# EAGLE design bubbledisplayfrontpack.v02 (EAGLE 6.6.0)
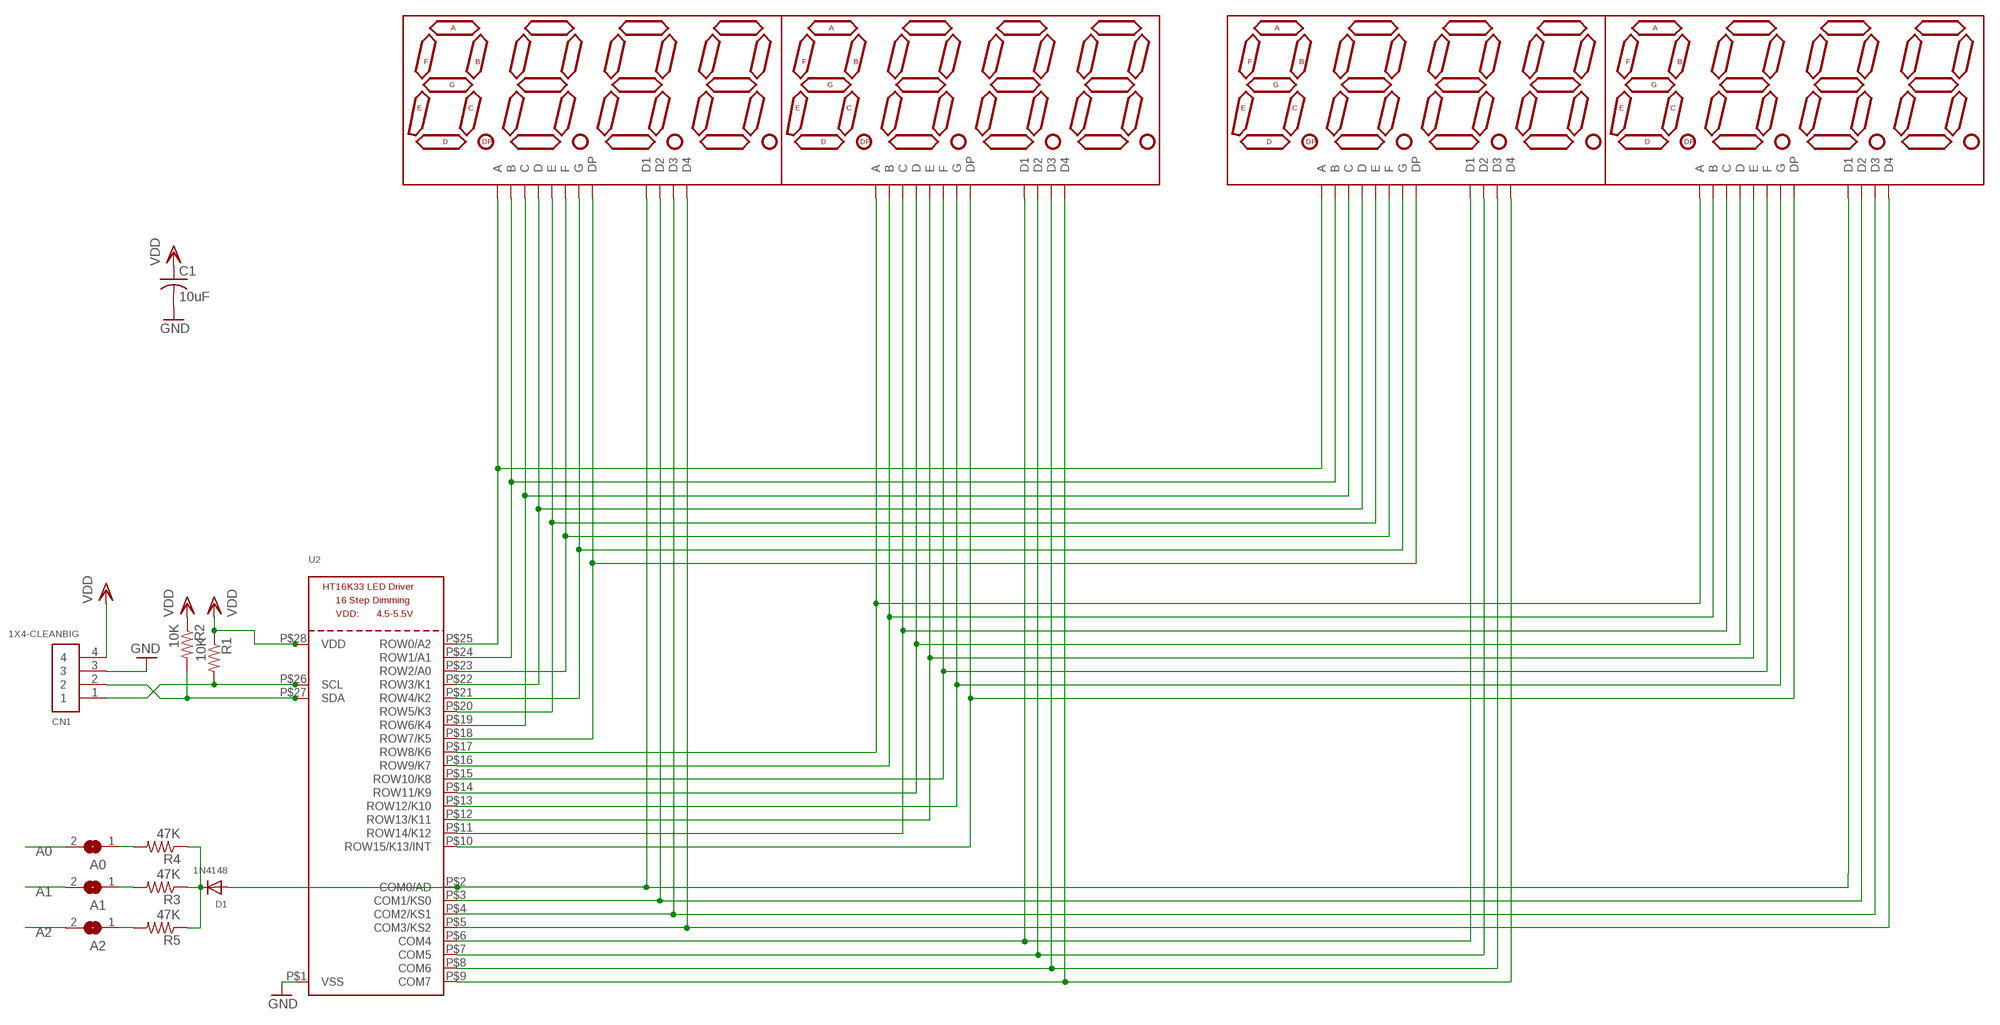
[diagram p0: schematic, sheet 1]

## Parts
A0  SOLDERJUMPERREFLOW_NOPASTE  [SOLDERJUMPER_REFLOW_NOPASTE]
A1  SOLDERJUMPERREFLOW_NOPASTE  [SOLDERJUMPER_REFLOW_NOPASTE]
A2  SOLDERJUMPERREFLOW_NOPASTE  [SOLDERJUMPER_REFLOW_NOPASTE]
C1  10uF  C-USC0805K  [C0805K]
CN1  1X4-CLEANBIG  [1X04-CLEANBIG]
D1  1N4148  DIODESOD-323F  [SOD-323F]
DISPLAY1  hp  7-SEGMENT-4DIGIT-COUNTER-HP-BUBBLE  [DIL12]
DISPLAY2  hp  7-SEGMENT-4DIGIT-COUNTER-HP-BUBBLE  [DIL12]
DISPLAY3  hp  7-SEGMENT-4DIGIT-COUNTER-HP-BUBBLE  [DIL12]
DISPLAY4  hp  7-SEGMENT-4DIGIT-COUNTER-HP-BUBBLE  [DIL12]
R1  10K  R-US_R0805  [R0805]
R2  10K  R-US_R0805  [R0805]
R3  47K  R-US_R0805  [R0805]
R4  47K  R-US_R0805  [R0805]
R5  47K  R-US_R0805  [R0805]
U2  HT16K33_SOP28  [SOP28_300MIL]

## Nets
A0: A0.2 DISPLAY1.9(F) DISPLAY3.9(F) U2.P$23(ROW2/A0)
A1: A1.2 DISPLAY1.11(B) DISPLAY3.11(B) U2.P$24(ROW1/A1)
A2: A2.2 DISPLAY1.12(A) DISPLAY3.12(A) U2.P$25(ROW0/A2)
C0P1: D1.A DISPLAY2.1(D1) DISPLAY3.1(D1) U2.P$2(COM0/AD)
C1P10: DISPLAY2.10(D2) DISPLAY3.10(D2) U2.P$3(COM1/KS0)
C2P4: DISPLAY2.4(D3) DISPLAY3.4(D3) U2.P$4(COM2/KS1)
C3P6: DISPLAY2.6(D4) DISPLAY3.6(D4) U2.P$5(COM3/KS2)
C4P1: DISPLAY1.1(D1) DISPLAY4.1(D1) U2.P$6(COM4)
C5P10: DISPLAY1.10(D2) DISPLAY4.10(D2) U2.P$7(COM5)
C6P4: DISPLAY1.4(D3) DISPLAY4.4(D3) U2.P$8(COM6)
C7P6: DISPLAY1.6(D4) DISPLAY4.6(D4) U2.P$9(COM7)
GND: C1.2 CN1.3 U2.P$1(VSS)
N$1: D1.C R3.1 R4.1 R5.1
N$3: DISPLAY1.8(D) DISPLAY3.8(D) U2.P$22(ROW3/K1)
N$5: DISPLAY2.9(F) DISPLAY4.9(F) U2.P$15(ROW10/K8)
N$7: A2.1 R5.2
N$8: DISPLAY2.2(E) DISPLAY4.2(E) U2.P$12(ROW13/K11)
N$19: A1.1 R3.2
N$20: A0.1 R4.2
SCL: CN1.1 R1.2 U2.P$26(SCL)
SDA: CN1.2 R2.2 U2.P$27(SDA)
SEGAD24P12: DISPLAY2.12(A) DISPLAY4.12(A) U2.P$17(ROW8/K6)
SEGBD24P11: DISPLAY2.11(B) DISPLAY4.11(B) U2.P$16(ROW9/K7)
SEGCP3: DISPLAY2.3(C) DISPLAY4.3(C) U2.P$11(ROW14/K12)
SEGD13EP2: DISPLAY1.7(G) DISPLAY3.7(G) U2.P$21(ROW4/K2)
SEGD13GP7: DISPLAY1.3(C) DISPLAY3.3(C) U2.P$19(ROW6/K4)
SEGDD24P8: DISPLAY2.8(D) DISPLAY4.8(D) U2.P$14(ROW11/K9)
SEGDPD13P5: DISPLAY1.5(DP) DISPLAY3.5(DP) U2.P$18(ROW7/K5)
SEGDPP5: DISPLAY2.5(DP) DISPLAY4.5(DP) U2.P$10(ROW15/K13/INT)
SEGED13P2: DISPLAY1.2(E) DISPLAY3.2(E) U2.P$20(ROW5/K3)
SEGFP9: DISPLAY2.7(G) DISPLAY4.7(G) U2.P$13(ROW12/K10)
VDD: C1.1 CN1.4 R1.1 R2.1 U2.P$28(VDD)

## Library data of the parts
A0 A1 A2 = microbuilder:SOLDERJUMPER: SMD Solder JUMPER Solder the two pads together to create a connection, or remove the solder to break it. REFLOW - Use this footprint for solder paste and reflow ovens. WAVE - Use this footprint for hand-soldering (larger pads). CLOSED - Has a trace between the two pads to ensure it is closed by default. The trace needs to be cut to disable the jumper, and can be closed again by creating a solder bridge between the two pads.
C1 = adafruit:C-US: CAPACITOR, American symbol
CN1 = adafruit:1X4: 4-pin connector
D1 = adafruit:DIODE: Diode SMADIODE - SMA Surface Mount Package 20V 1A Schottky Diode Digikey: 641-1014-6-ND DO-1N4148 - Through Hole Small Current Diode SOD-123 20V 1 A (.5mV Vf) Schottky Diode - Digikey: MBRX120TPMSCT-ND SOD-323 10V 570mA (.38mV Vf, 3ns) Schottky Diode - Digikey: ZLLS410CT-ND SOD-523 30V 30mA Schottky Diode (RB751S-40TE61) - Digikey: RB751S-40TE61CT-ND SOT23-R/W - SOT23 Package (R = Solder Paste/Reflow Ovens, W = Hand-Soldering) BAT54Film 40V 300mA - Digikey: 497-7162-1-ND
DISPLAY1-DISPLAY4 = SparkFun-Displays:7-SEGMENT-4DIGIT-COUNTER
R1-R5 = adafruit:R-US_: RESISTOR, American symbol
U2 = microbuilder:HT16K33_SOP28

## Board
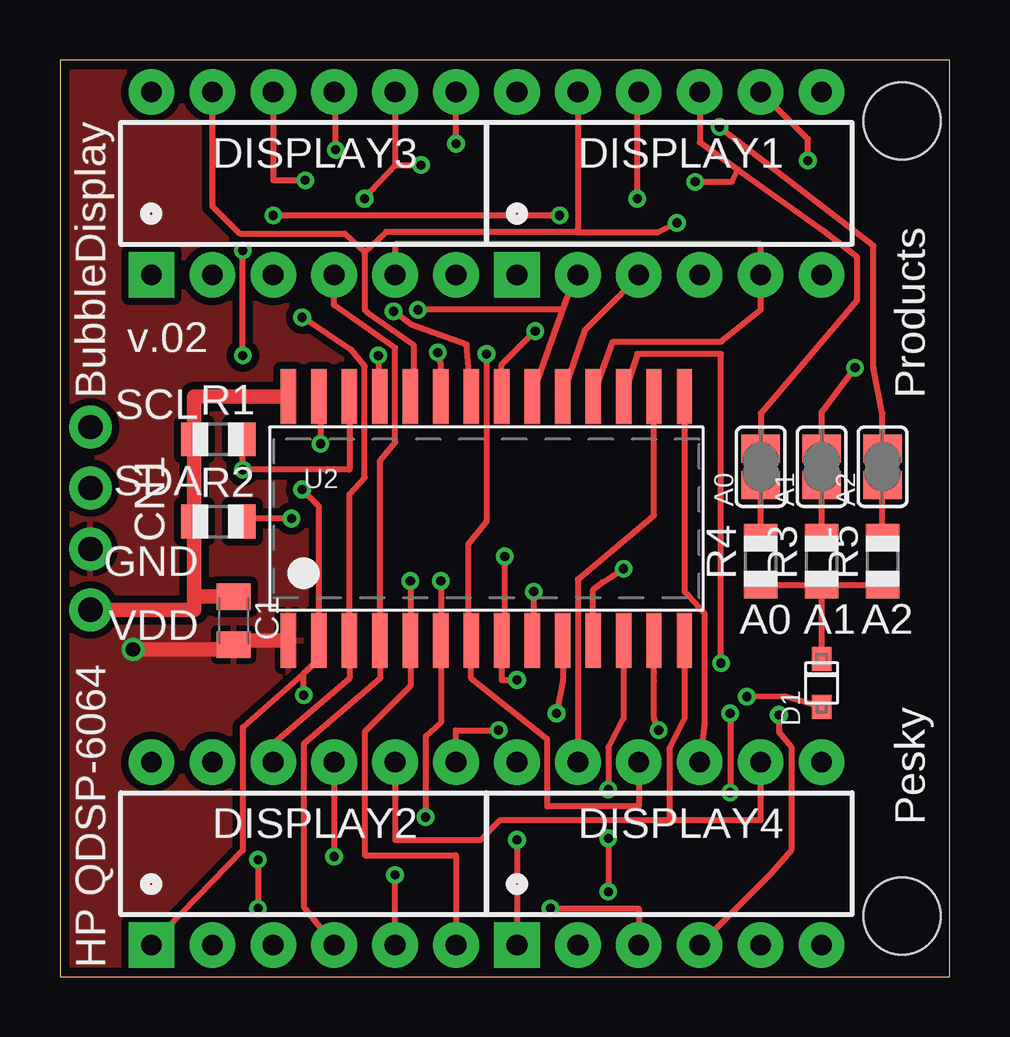
[diagram p1: board, top side]
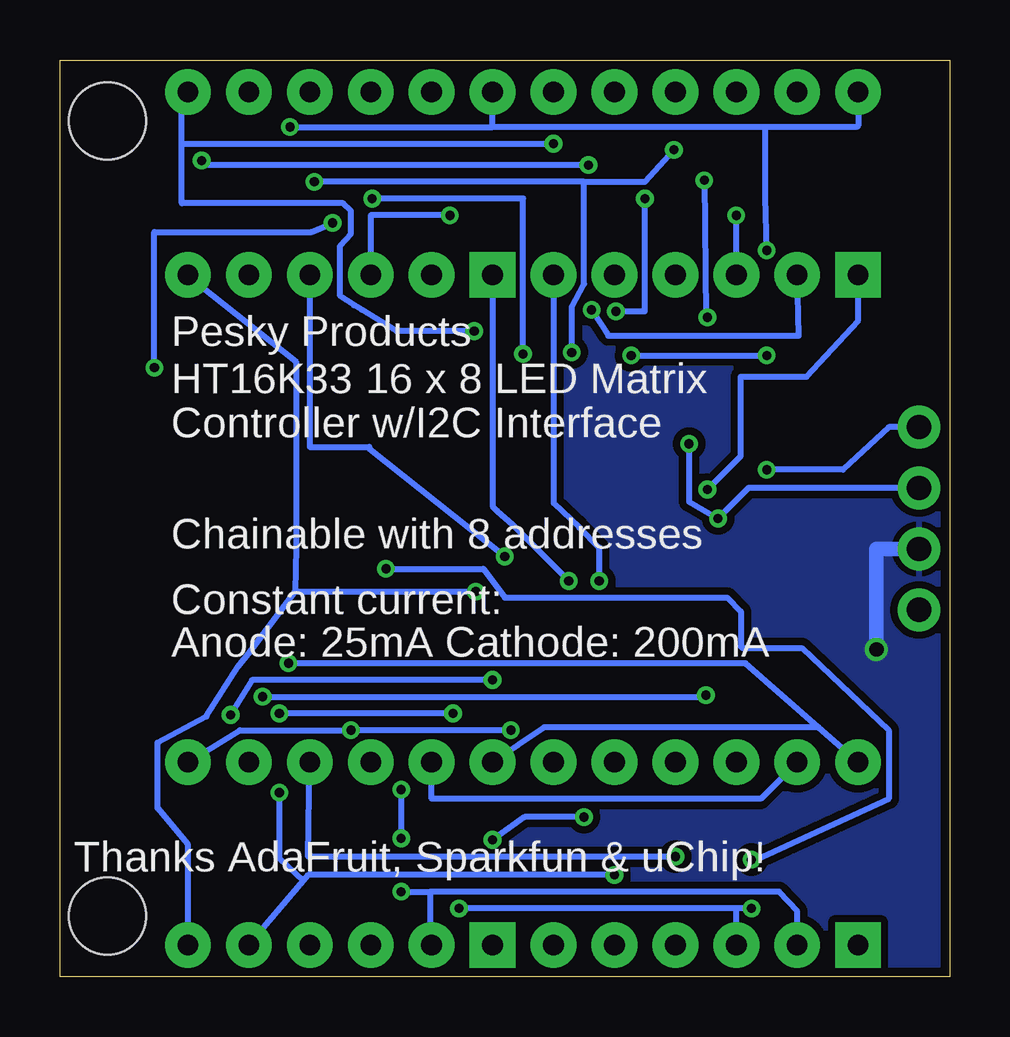
[diagram p2: board, bottom side, seen from below]

Size 37.08 x 38.23 mm. Coordinates in mm from the lower left corner, seen from the top.
Outline: 0,38.23 0,0 37.08,0 37.08,38.23 0,38.23
Copper layers (1*16): Top 0.0356mm / dielectric 1.5011mm / Bottom 0.0356mm
Design rules "OSHPark *": minimum track width 6mil, minimum drill 13mil, track to track 6mil, track to pad 6mil, pad to pad 6mil, via to via 6mil, smd to smd 6mil, copper to edge 15mil, drill to drill 6mil, minimum pad ring 7mil, minimum via ring 7mil, stop-mask expansion 3mil, vias tented up to drill 25mil, thermal gap 10mil
Holes 3.2 mm at 35.11,35.69 35.11,2.54

### Footprints (pad centres in the part's own frame; a part is rotated, then mirrored left to right if it is on the bottom)
SOLDERJUMPER_REFLOW_NOPASTE = smd 1.168 x 1.6: 1 -0.762,0; 2 0.762,0
C0805K = smd 1.1 x 1.4: 1 -1,0; 2 1,0
1X04-CLEANBIG = drill 1.016 pad 1.778: 1 -3.81,0; 2 -1.27,0; 3 1.27,0; 4 3.81,0
SOD-323F = smd 1 x 0.8: A -1,0; C 1,0
DIL12 = drill 0.864 pad 1.905 square: 1 -6.35,-3.81 | drill 0.864 pad 1.905: 2 -3.81,-3.81; 3 -1.27,-3.81; 4 1.27,-3.81; 5 3.81,-3.81; 6 6.35,-3.81; 7 6.35,3.81; 8 3.81,3.81; 9 1.27,3.81; 10 -1.27,3.81; 11 -3.81,3.81; 12 -6.35,3.81
R0805 = smd 1.1 x 1.4: 1 -1,0; 2 1,0
SOP28_300MIL = smd 0.635 x 2.286: P$1 -8.255,-5.08; P$2 -6.985,-5.08; P$3 -5.715,-5.08; P$4 -4.445,-5.08; P$5 -3.175,-5.08; P$6 -1.905,-5.08; P$7 -0.635,-5.08; P$8 0.635,-5.08; P$9 1.905,-5.08; P$10 3.175,-5.08; P$11 4.445,-5.08; P$12 5.715,-5.08; P$13 6.985,-5.08; P$14 8.255,-5.08; P$15 8.255,5.08; P$16 6.985,5.08; P$17 5.715,5.08; P$18 4.445,5.08; P$19 3.175,5.08; P$20 1.905,5.08; P$21 0.635,5.08; P$22 -0.635,5.08; P$23 -1.905,5.08; P$24 -3.175,5.08; P$25 -4.445,5.08; P$26 -5.715,5.08; P$27 -6.985,5.08; P$28 -8.255,5.08

### Placement (x,y rotation side)
A0  29.21,21.27 90 top
A1  31.75,21.27 90 top
A2  34.29,21.27 90 top
C1  7.24,14.86 270 top
CN1  1.27,19.11 270 top
D1  31.75,12.26 90 top
DISPLAY1  25.4,33.08 0 top
DISPLAY2  10.16,5.14 0 top
DISPLAY3  10.16,33.08 0 top
DISPLAY4  25.4,5.14 0 top
R1  6.6,22.42 0 top
R2  6.6,18.99 0 top
R3  31.75,17.34 90 top
R4  29.21,17.34 90 top
R5  34.29,17.34 90 top
U2  17.78,19.11 0 top

### Tracks (layer width: path | path; a pad name or v marks a point on that pad's centre or on a via)
A0  (via drill 0.38)
  Top 0.254: DISPLAY1.9 26.67,34.8 28.26,33.66 | 28.26,33.66 31.81,31.11 33.21,30.04 33.21,28.19 29.21,23.5 A0.2 | U2.P$23 15.88,25.53 v15.75,26.04 | v11.49,34.48 11.49,36.83 DISPLAY3.9 | v26.48,33.15 28,33.15 28.26,33.66
  Bottom 0.254: v15.75,26.04 15.75,27.94 15.24,28.89 15.24,33.15 | 15.24,33.15 12.7,33.15 v11.49,34.48 | 15.24,33.15 v26.48,33.15
A1  (via drill 0.38)
  Top 0.254: DISPLAY3.11 6.35,32.13 7.49,30.99 11.87,30.99 12.7,30.23 | 12.7,30.23 12.7,27.81 12.83,27.69 14.73,26.35 14.73,24.32 U2.P$24 | DISPLAY1.11 21.59,31.18 21.53,31.05 | 21.53,31.05 24.96,31.05 v25.72,31.43 | 21.53,31.05 13.59,31.05 12.7,30.23 | A1.2 31.75,23.56 v33.15,25.4
  Bottom 0.254: v33.15,25.4 33.15,31.05 26.61,31.05 v25.72,31.43
A2  (via drill 0.38)
  Top 0.254: v27.5,35.43 33.91,30.48 33.91,25.4 34.29,23.5 A2.2 | U2.P$25 v13.27,25.91 | v7.62,25.91 v7.62,30.29
  Bottom 0.254: DISPLAY3.12 3.81,35.5 3.87,35.43 7.68,35.43 | 7.68,35.43 19.05,35.43 | 19.05,35.43 DISPLAY1.12 | v27.5,35.43 19.05,35.43 | v13.27,25.91 v7.62,25.91 | v7.62,30.29 7.68,32.51 7.68,35.43
C0P1  (via drill 0.38)
  Top 0.254: 10.31,12.81 10.79,13.27 U2.P$2 10.79,19.62 v10.1,20.32 | 10.31,12.81 7.62,10.41 7.62,5.27 DISPLAY2.1 | D1.A 30.21,11.7 v28.64,11.68 | v10.16,11.75 10.16,12.66 10.31,12.81
  Bottom 0.254: v28.64,11.68 10.35,11.68 v10.16,11.75 | v10.1,20.32 8.7,21.72 8.7,25.02 5.97,25.02 3.81,27.37 DISPLAY3.1
C1P10  (via drill 0.38)
  Top 0.254: DISPLAY2.10 8.89,9.72 9.78,10.48 12.06,12.45 U2.P$3 12.06,20.13 12.7,20.83 12.7,25.46 12.13,26.16 10.16,27.5 v10.1,27.5 | DISPLAY3.10 8.89,33.21 v10.22,33.21
  Bottom 0.254: v10.22,33.21 10.16,27.56 v10.1,27.5
C2P4
  Top 0.254: DISPLAY2.4 10.16,2.92 10.16,9.72 13.34,12.45 U2.P$4 13.34,21.53 13.97,22.29 13.97,26.23 11.43,28 DISPLAY3.4
C3P6  (via drill 0.38)
  Top 0.254: DISPLAY2.6 16.51,5.08 12.7,5.08 12.7,10.22 14.61,12.13 U2.P$5 v14.61,16.51
  Bottom 0.254: DISPLAY3.6 16.51,19.75 15.43,18.73 14.61,17.91 v14.61,16.51
C4P1  (via drill 0.38)
  Top 0.254: v15.88,16.51 U2.P$6 15.88,10.6 15.24,10.03 v15.24,6.67 | v19.05,5.71 DISPLAY4.1
  Bottom 0.254: DISPLAY1.1 19.05,19.62 18.86,19.43 18.22,18.86 v15.88,16.51 | v15.24,6.67 17.72,6.67 v19.05,5.71
C5P10  (via drill 0.38)
  Top 0.254: v17.78,25.97 17.78,18.99 17.02,18.03 17.02,14.16 U2.P$7 17.14,12.45 20.32,9.91 20.32,7.11 24.13,7.11 DISPLAY4.10 | v24.07,32.45 24.07,36.83 DISPLAY1.10
  Bottom 0.254: v17.78,25.97 17.78,32.45 v24.07,32.45
C6P4  (via drill 0.38)
  Top 0.254: v18.54,17.53 18.54,14.16 U2.P$8 18.41,12.38 v19.05,12.38 | v29.97,10.92 29.97,10.22 30.48,9.59 30.48,5.27 29.59,4.25 DISPLAY4.4
  Bottom 0.254: DISPLAY1.4 26.67,22.1 24.19,22.1 24.19,22.04 v18.54,17.53 | v19.05,12.38 29.08,12.38 29.91,11.05 v29.97,10.92
C7P6  (via drill 0.38)
  Top 0.254: U2.P$9 19.81,14.16 | 19.68,13.4 U2.P$9 | v19.75,16.07 19.75,14.1 U2.P$9
  Bottom 0.254: DISPLAY1.6 31.75,29.21 27.24,25.65 27.24,17.91 27.27,16.07 | 27.27,16.07 v19.75,16.07 | DISPLAY4.6 31.75,5.52 33.02,7.05 33.02,9.78 30.99,10.86 29.65,12.95 29.15,13.59 27.27,16.07
GND  (via drill 0.6)
  Top 0.61: v3.05,13.65 6.6,13.65 C1.2 7.81,14.03 U2.P$1
  Bottom 0.61: CN1.3 3.05,17.84 v3.05,13.65
  pour Top (isolate 0.305): 0,38.23 0,0 37.47,0 37.47,38.23
  pour Bottom (isolate 0.305): 0,38.23 0,0 37.47,0 37.47,38.23
N$1
  Top 0.254: D1.C R3.1 | R4.1 R3.1 | R3.1 R5.1
N$3  (via drill 0.38)
  Top 0.254: DISPLAY3.8 13.97,33.85 | 13.97,33.85 v15.05,33.85 | v31.18,34.04 31.18,34.92 DISPLAY1.8 | U2.P$22 16.95,26.35 14.67,27.18 v13.91,27.75 | v12.7,32.45 12.95,32.77 13.97,33.85
  Bottom 0.254: v15.05,33.85 31.18,33.85 v31.18,34.04 | v13.91,27.75 12.7,27.75 v12.7,32.45
N$5  (via drill 0.38)
  Top 0.254: U2.P$15 26.04,16.07 26.23,15.88 26.86,15.18 26.86,10.54 DISPLAY4.9 | DISPLAY2.9 v11.43,5.02
  Bottom 0.254: v11.43,5.02 26.73,5.02 DISPLAY4.9
N$7
  Top 0.254: R5.2 A2.1
N$8  (via drill 0.38)
  Top 0.254: U2.P$12 23.5,10.79 22.86,9.59 v22.86,7.81 22.86,7.75 | v22.86,5.78 v22.86,3.56
  Bottom 0.254: DISPLAY2.2 6.35,2.73 7.11,3.56 21.65,3.56 | 21.65,3.56 21.65,1.4 DISPLAY4.2 | v22.86,7.81 v22.86,5.78 | v22.86,3.56 21.65,3.56
N$19
  Top 0.254: R3.2 A1.1
N$20
  Top 0.254: R4.2 A0.1
SCL  (via drill 0.38)
  Top 0.254: R1.2 7.62,21.97 v7.62,21.14 12.06,21.14 U2.P$26
  Bottom 0.254: CN1.1 2.54,22.92 4.45,21.14 v7.62,21.14
SDA  (via drill 0.38)
  Top 0.254: v9.65,19.11 7.87,19.11 R2.2 | U2.P$27 10.67,24.19 10.67,23.94 10.86,23.94 v10.86,22.23
  Bottom 0.254: CN1.2 8.38,20.38 v9.65,19.11 10.86,19.81 v10.86,22.23
SEGAD24P12  (via drill 0.38)
  Top 0.254: v27.56,13.08 27.56,25.97 24.07,25.97 U2.P$17
  Bottom 0.254: 5.46,10.41 8.51,13.08 v27.56,13.08 | 5.46,10.41 16.89,10.41 DISPLAY4.12 | DISPLAY2.12 5.46,10.41
SEGBD24P11
  Top 0.254: U2.P$16 24.77,19.24 21.59,16.57 DISPLAY4.11
  Bottom 0.254: DISPLAY2.11 7.87,7.43 21.59,7.43 DISPLAY4.11
SEGCP3  (via drill 0.38)
  Top 0.254: v20.45,2.86 24.13,2.86 DISPLAY4.3 | U2.P$11 22.23,16.13 22.29,16.19 22.61,16.45 v23.5,17.02 | v8.26,4.89 v8.26,2.86
  Bottom 0.254: DISPLAY2.3 8.89,2.86 | 8.89,2.86 v20.45,2.86 | v23.5,17.02 19.43,17.02 18.54,15.81 9.27,15.81 8.7,15.24 8.7,13.78 8.64,13.72 6.16,13.72 2.54,10.29 2.54,7.43 8.06,4.89 v8.26,4.89 | v8.26,2.86 8.89,2.86
SEGD13EP2  (via drill 0.38)
  Top 0.254: v16.51,34.73 DISPLAY3.7 | U2.P$21 18.41,25.53 v19.81,26.92
  Bottom 0.254: 32,34.73 v16.51,34.73 | v19.81,26.92 23.05,26.92 24.51,27.81 24.83,28 25.4,28.38 25.4,30.48 24.96,30.99 24.96,31.94 25.27,32.26 32,32.26 32,34.73 | 32,34.73 32,36.07 DISPLAY1.7
SEGD13GP7  (via drill 0.38)
  Top 0.254: U2.P$19 21.46,25.72 21.91,26.99 23.24,28.32 DISPLAY1.3 | v8.89,31.75 v20.83,31.75
  Bottom 0.254: DISPLAY3.3 v8.89,31.75 | v20.83,31.75 24.13,31.75 DISPLAY1.3
SEGDD24P8
  Top 0.254: U2.P$14 26.04,10.79 25.4,9.53 25.4,6.54 | 25.4,6.54 29.21,6.54 DISPLAY4.8 | DISPLAY2.8 13.97,5.71 17.53,5.71 18.35,6.54 25.4,6.54
SEGDPD13P5
  Top 0.254: DISPLAY3.5 13.97,30.54 29.21,30.54 DISPLAY1.5 29.21,27.81 27.56,26.48 23.05,26.48 U2.P$18
SEGDPP5  (via drill 0.38)
  Top 0.254: U2.P$10 20.96,13.31 20.96,12.39 v20.7,10.99 | DISPLAY2.5 v13.97,4.25 | v27.94,10.99 v27.94,7.68
  Bottom 0.254: v13.97,4.25 26.73,4.25 26.94,4.01 | 26.94,4.01 DISPLAY4.5 | v20.7,10.99 v27.94,10.99 | v27.94,7.68 27.94,4.95 26.94,4.01
SEGED13P2  (via drill 0.38)
  Top 0.254: 20.96,27.81 v14.92,27.81 | U2.P$20 20.51,26.54 20.96,27.81 | 20.96,27.81 21.16,28.35 21.34,28.77 DISPLAY1.2
  Bottom 0.254: v14.92,27.81 14.22,26.73 6.29,26.73 DISPLAY3.2
SEGFP9  (via drill 0.38)
  Top 0.254: U2.P$13 24.77,12.7 24.77,12.34 24.77,10.81 v24.96,10.29 | DISPLAY2.7 16.51,10.29 v18.29,10.29
  Bottom 0.254: v18.29,10.29 v24.96,10.29 29.59,10.29 31.56,9.08 DISPLAY4.7
VDD
  Top 0.254: 5.59,23.43 5.6,24.19
  Top 0.61: C1.1 5.6,15.86 | 5.6,15.86 R2.1 R1.1 5.6,24.19 U2.P$28 | 5.6,15.86 5.6,15.3 CN1.4

### Text on the board
tPlace: v.02 | SCL | BubbleDisplay | Products | SDA | GND | VDD | A0 | A1 | A2 | Pesky | HP QDSP-6064
bPlace: Pesky Products | HT16K33 16 x 8 LED Matrix | Controller w/I2C Interface | Chainable with 8 addresses | Constant current: | Anode: 25mA Cathode: 200mA | Thanks AdaFruit, Sparkfun & uChip!